# Altium schematic sheet lapwing2p2.SchDoc: lapwing2p2
size A2; Date: 31/08/2021; ApprovedBy: Nick Bassett; Author: Anthony Chiam; CompanyName: UQ Space; DrawnBy: Anthony Chiam; Engineer: Anthony Chiam; Organization: UQ Space; Address1: Room 113, Bldg 74,; Address2: Coopers Road; Address3: UQ St Lucia Campus; Address4: ST LUCIA QLD 4072; DocumentNumber: 1; Revision: 2p2; SheetNumber: 1; SheetTotal: 1; Time: 22:00
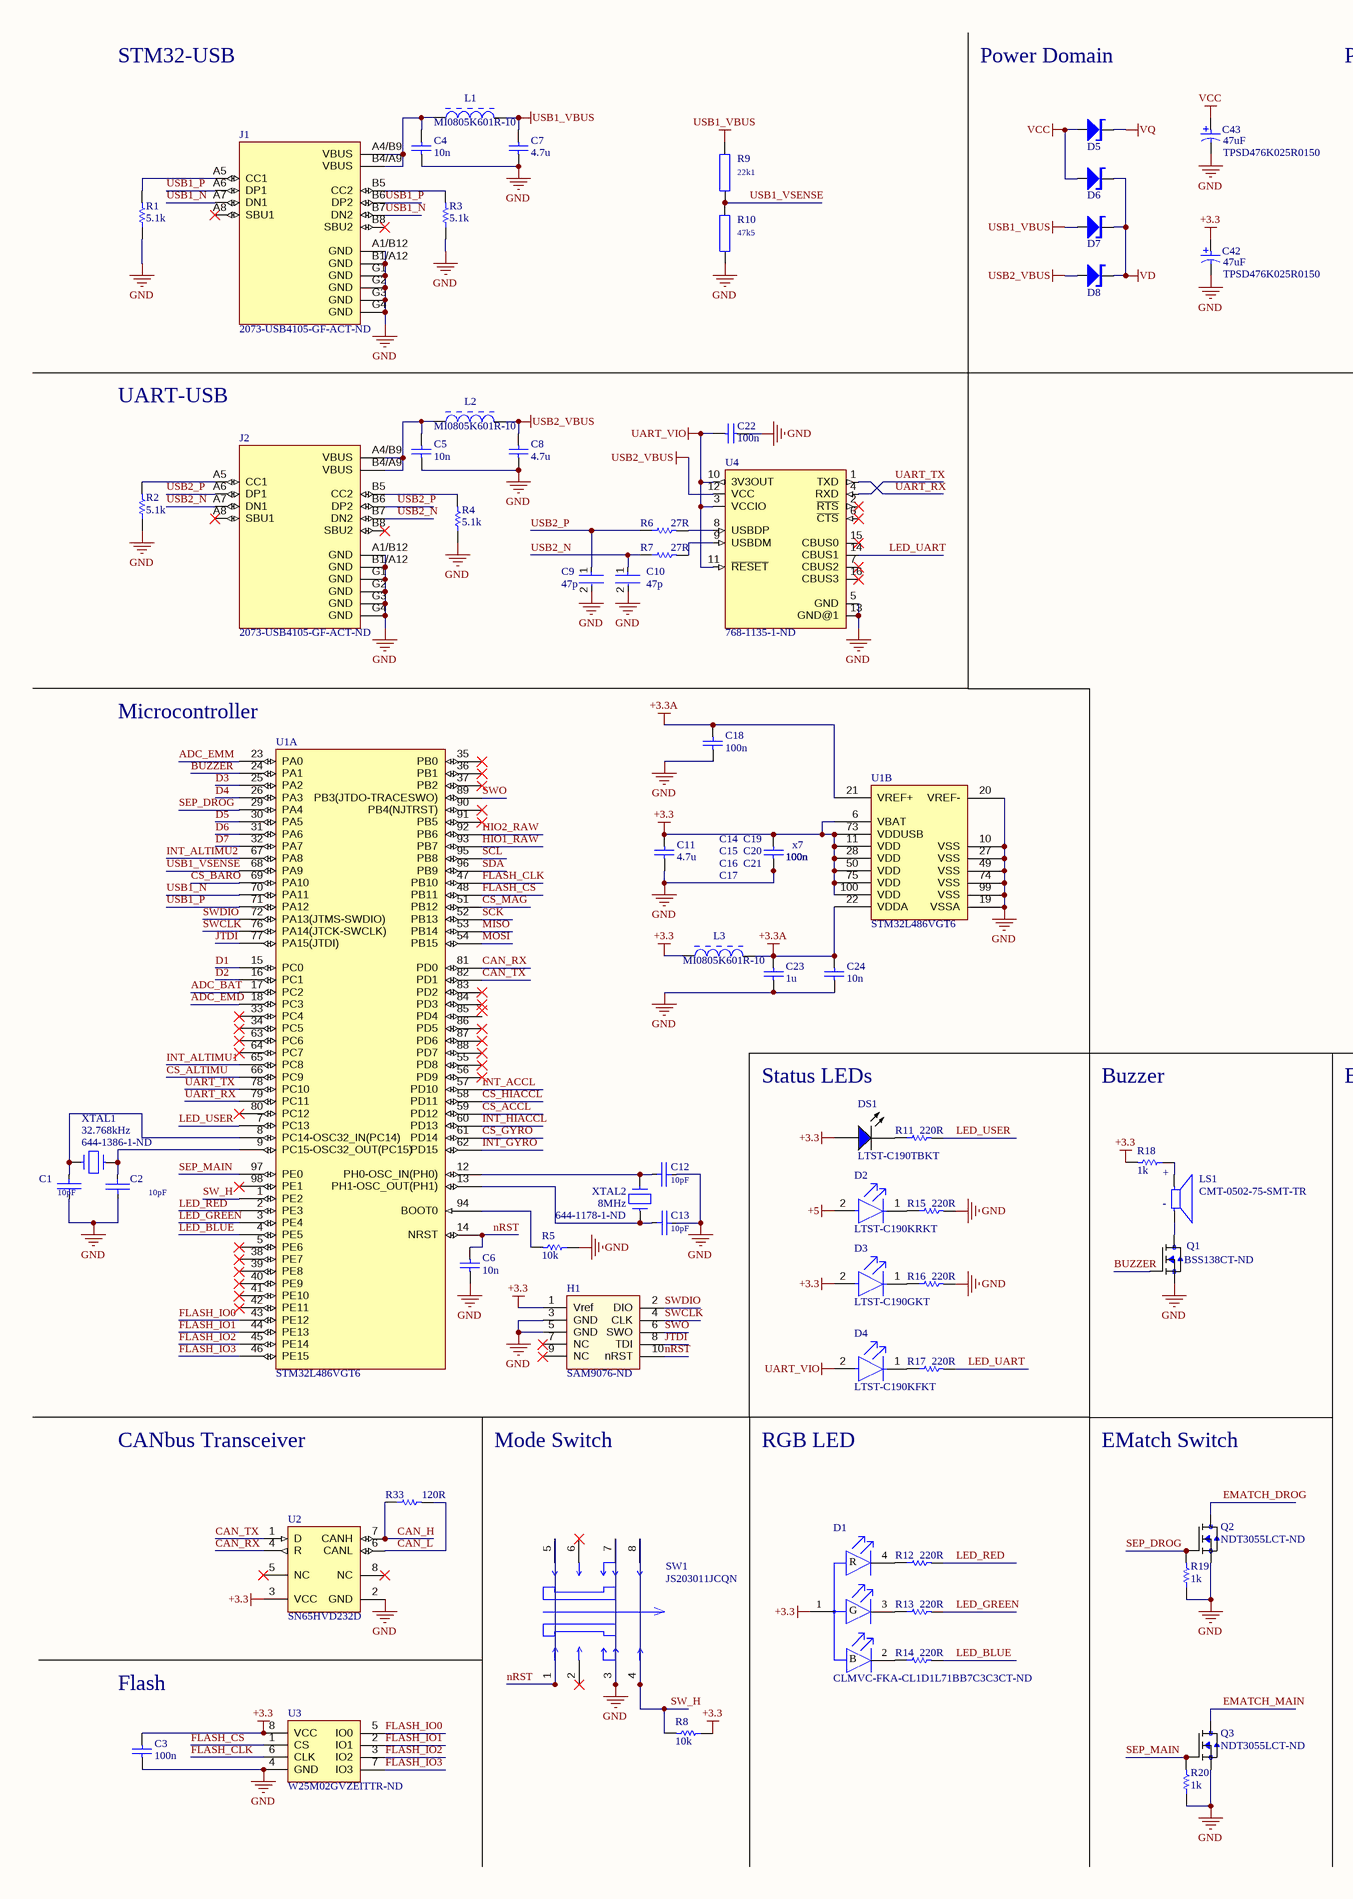
[diagram p0: lapwing2p2.SchDoc, left]
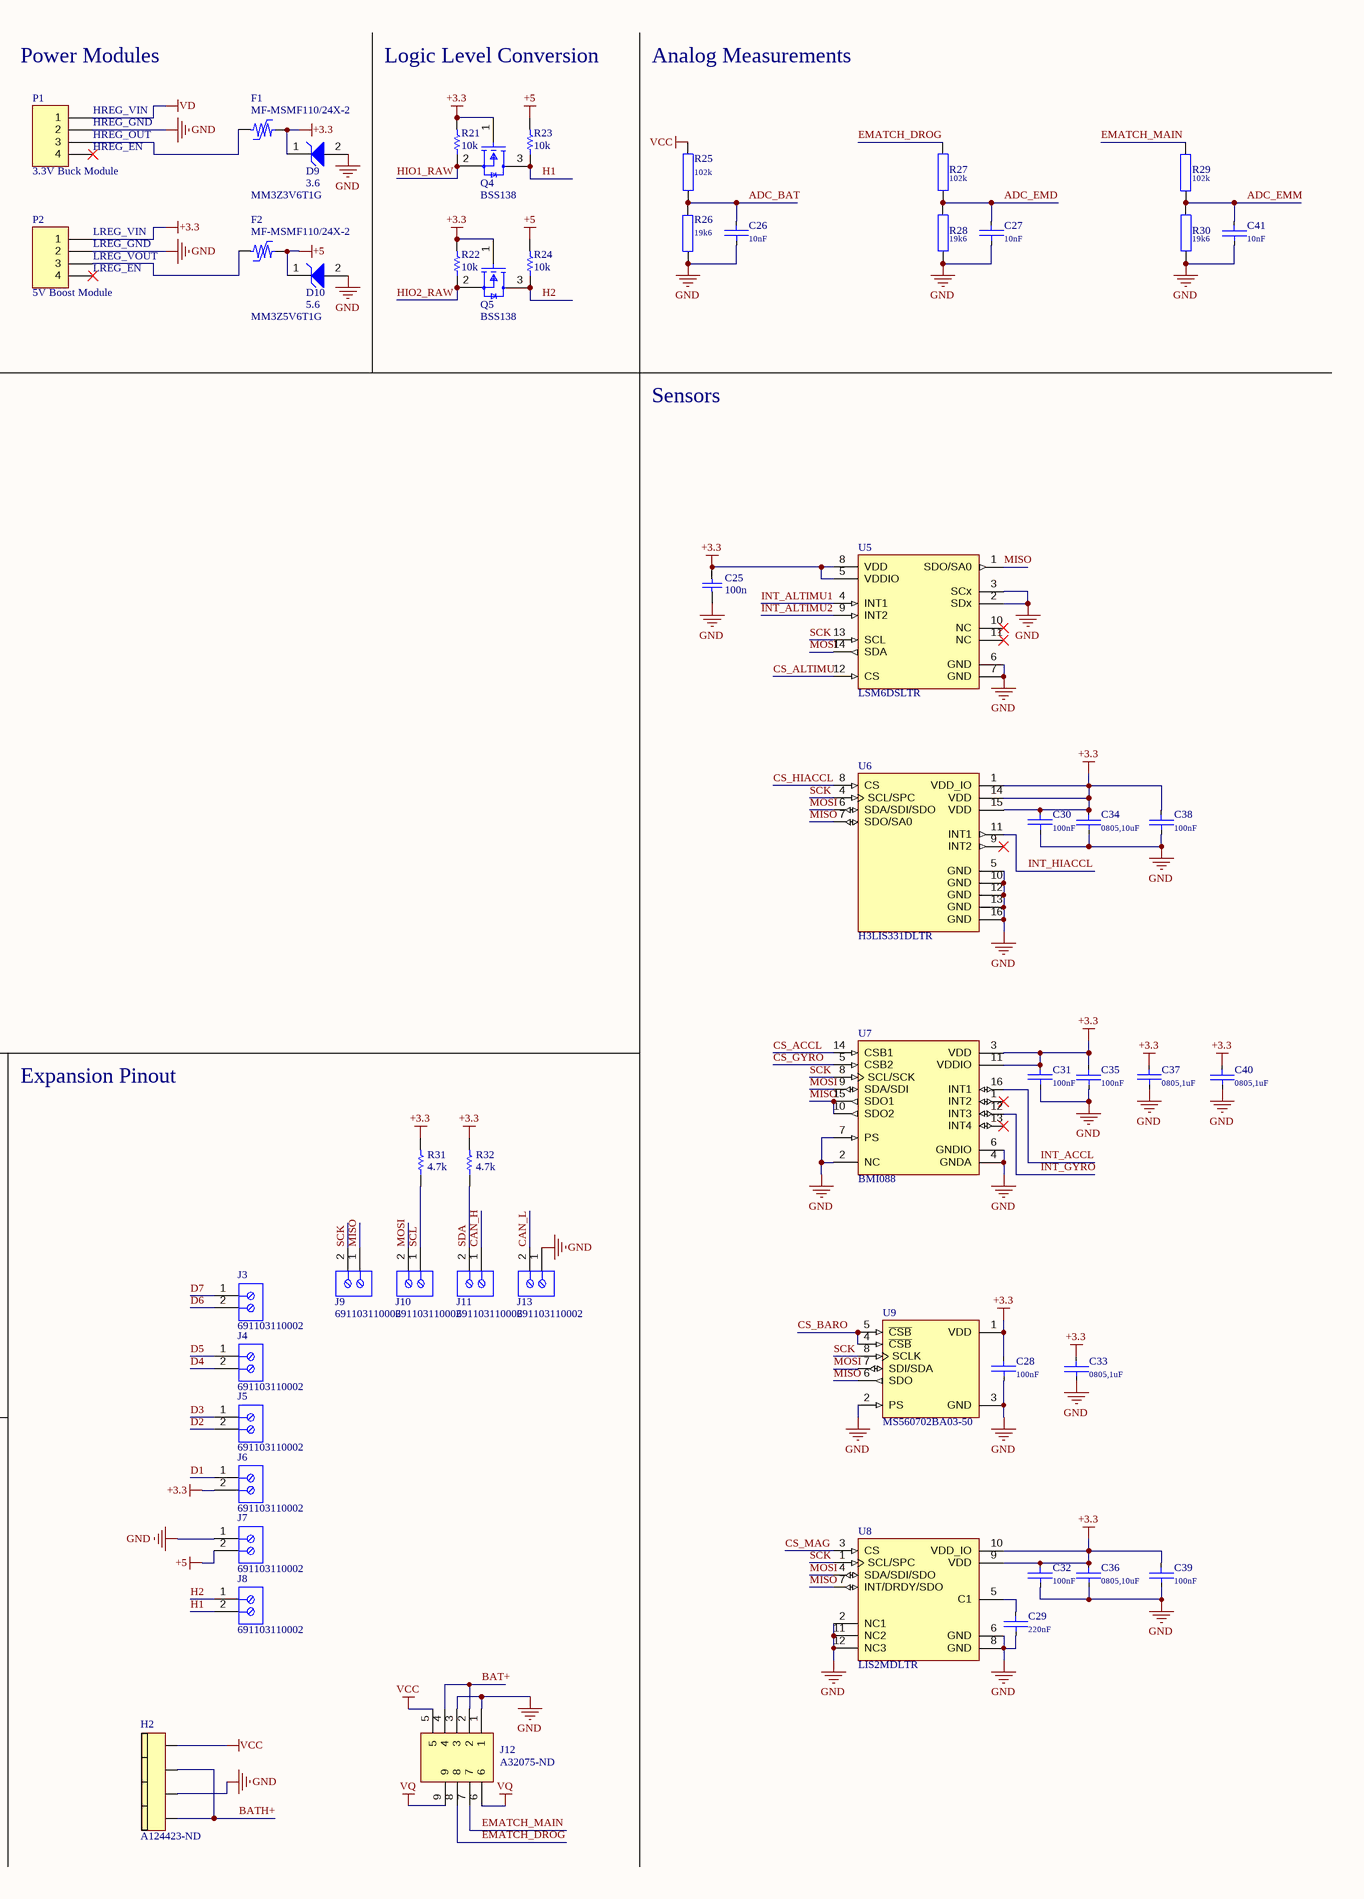
[diagram p1: lapwing2p2.SchDoc, right]

## Parts
C1  CAP  [C0603]  (value not drawn)
C2  CAP  [C0603]  (value not drawn)
C3  value 100n  [CAPC1608X90X35ML10T15]  (hidden comment: GRM188R71H104KA93D)
C4  value 10n  [CAPC1608X90X35ML10T15]  (hidden comment: GRM188R71H103KA01D)
C5  value 10n  [CAPC1608X90X35ML10T15]  (hidden comment: GRM188R71H103KA01D)
C6  value 10n  [CAPC1608X90X35ML10T15]  (hidden comment: GRM188R71H103KA01D)
C7  value 4.7u  [CAPC2013X135X45NL10T25]  (hidden comment: GRM21BR61E475KA12L)
C8  value 4.7u  [CAPC2013X135X45NL10T25]  (hidden comment: GRM21BR61E475KA12L)
C9  value 47p  [FP-C0603C-CF-MFG]  (hidden comment: C0603C470J5GACTU)
C10  value 47p  [FP-C0603C-CF-MFG]  (hidden comment: C0603C470J5GACTU)
C11  value 4.7u  [CAPC2013X135X45NL10T25]  (hidden comment: GRM21BR61E475KA12L)
C12  CAP  [C0603]  (value not drawn)
C13  CAP  [C0603]  (value not drawn)
C14  value 100n  [CAPC1608X90X35ML10T15]  (hidden comment: GRM188R71H104KA93D)
C15  value 100n  [CAPC1608X90X35ML10T15]  (hidden comment: GRM188R71H104KA93D)
C16  value 100n  [CAPC1608X90X35ML10T15]  (hidden comment: GRM188R71H104KA93D)
C17  value 100n  [CAPC1608X90X35ML10T15]  (hidden comment: GRM188R71H104KA93D)
C18  value 100n  [CAPC1608X90X35ML10T15]  (hidden comment: GRM188R71H104KA93D)
C19  value 100n  [CAPC1608X90X35ML10T15]  (hidden comment: GRM188R71H104KA93D)
C20  value 100n  [CAPC1608X90X35ML10T15]  (hidden comment: GRM188R71H104KA93D)
C21  value 100n  [CAPC1608X90X35ML10T15]  (hidden comment: GRM188R71H104KA93D)
C22  value 100n  [CAPC1608X90X35ML10T15]  (hidden comment: GRM188R71H104KA93D)
C23  value 1u  [CAPC1608X90X35NL10T15]  (hidden comment: GRM188R71E105KA12D)
C24  value 10n  [CAPC1608X90X35ML10T15]  (hidden comment: GRM188R71H103KA01D)
C25  value 100n  [CAPC1608X90X35ML10T15]  (hidden comment: GRM188R71H104KA93D)
C26  CAP  [C0603]  (value not drawn)
C27  CAP  [C0603]  (value not drawn)
C28  CAP  [C0603]  (value not drawn)
C29  CAP  [C0603]  (value not drawn)
C30  CAP  [C0603]  (value not drawn)
C31  CAP  [C0603]  (value not drawn)
C32  CAP  [C0603]  (value not drawn)
C33  CAP  [C0805]  (value not drawn)
C34  CAP  [C0805]  (value not drawn)
C35  CAP  [C0603]  (value not drawn)
C36  CAP  [C0805]  (value not drawn)
C37  CAP  [C0805]  (value not drawn)
C38  CAP  [C0603]  (value not drawn)
C39  CAP  [C0603]  (value not drawn)
C40  CAP  [C0805]  (value not drawn)
C41  CAP  [C0603]  (value not drawn)
C42  TPSD476K025R0150  value 47uF  [AVX-7343-31_L]
C43  TPSD476K025R0150  value 47uF  [AVX-7343-31_L]
D1  Supplier Part Number 1: CLMVC-FKA-CL1D1L71BB7C3C3CT-ND  [CLMVC-FKA]  (hidden comment: CLMVC-FKA-CL1D1L71BB7C3C3)
D2  LTST-C190KRKT  [FP-LTST-C190KRKT-MFG]
D3  LTST-C190GKT  [FP-LTST-C190GKT-MFG]
D4  LTST-C190KFKT  [FP-LTST-C190KFKT-MFG]
D5  PMEG6030EVPX  [D_PMEG6030EVPX]  (value not drawn)
D6  PMEG6030EVPX  [D_PMEG6030EVPX]  (value not drawn)
D7  PMEG6030EVPX  [D_PMEG6030EVPX]  (value not drawn)
D8  PMEG6030EVPX  [D_PMEG6030EVPX]  (value not drawn)
D9  MM3Z3V6T1G  VZ Typ (V): 3.6  [ONSC-SOD-323-2-477-02_V]
D10  MM3Z5V6T1G  VZ Typ (V): 5.6  [ONSC-SOD-323-2-477-02_V]
DS1  LTST-C190TBKT  [LTST-C190TBKT-2_V]
F1  MF-MSMF110/24X-2  [BOUR-MF-MSMF110-24X-2_V]
F2  MF-MSMF110/24X-2  [BOUR-MF-MSMF110-24X-2_V]
H1  Supplier Part Number 1: SAM9076-ND  [H_FTSH-105-01-L-DV-K-P]  (hidden comment: FTSH-105-01-L-DV-K-P)
H2  Supplier Part Number 1: A124423-ND  [H_282837-4]  (hidden comment: 282837-4)
J1  Supplier Part Number 1: 2073-USB4105-GF-ACT-ND  [H_GCT_USB4105-GF-A]  (hidden comment: USB4105-GF-A)
J2  Supplier Part Number 1: 2073-USB4105-GF-ACT-ND  [H_GCT_USB4105-GF-A]  (hidden comment: USB4105-GF-A)
J3  691103110002  [691103110002]
J4  691103110002  [691103110002]
J5  691103110002  [691103110002]
J6  691103110002  [691103110002]
J7  691103110002  [691103110002]
J8  691103110002  [691103110002]
J9  691103110002  [691103110002]
J10  691103110002  [691103110002]
J11  691103110002  [691103110002]
J12  Supplier Part Number 1: A32075-ND  [J_5745781-4]  (hidden comment: 5745781-4)
J13  691103110002  [691103110002]
L1  MI0805K601R-10  [LIRD-MI0805K601R-10-2_V]
L2  MI0805K601R-10  [LIRD-MI0805K601R-10-2_V]
L3  MI0805K601R-10  [LIRD-MI0805K601R-10-2_V]
LS1  CMT-0502-75-SMT-TR  [XDCR_CMT-0502-75-SMT-TR]
P1  3.3V Buck Module  [HDR1X4]
P2  5V Boost Module  [HDR1X4]
Q1  Supplier Part Number 1: BSS138CT-ND  [Q_BSS138]  (hidden comment: BSS138)
Q2  Supplier Part Number 1: NDT3055LCT-ND  [Q_NDT3055L]  (hidden comment: NDT3055L)
Q3  Supplier Part Number 1: NDT3055LCT-ND  [Q_NDT3055L]  (hidden comment: NDT3055L)
Q4  BSS138  [FP-318-08-IPC_B]
Q5  BSS138  [FP-318-08-IPC_B]
R1  value 5.1k  [RESC1608X55X30NL15T15]  (hidden comment: ERJ-3EKF5101V)
R2  value 5.1k  [RESC1608X55X30NL15T15]  (hidden comment: ERJ-3EKF5101V)
R3  value 5.1k  [RESC1608X55X30NL15T15]  (hidden comment: ERJ-3EKF5101V)
R4  value 5.1k  [RESC1608X55X30NL15T15]  (hidden comment: ERJ-3EKF5101V)
R5  value 10k  [RESC1609X55X30LL15T15]  (hidden comment: ERJ3EKF1002V)
R6  value 27R  [RESC1608X55X30NL15T15]  (hidden comment: ERJ3EKF27R0V)
R7  value 27R  [RESC1608X55X30NL15T15]  (hidden comment: ERJ3EKF27R0V)
R8  value 10k  [RESC1609X55X30LL15T15]  (hidden comment: ERJ3EKF1002V)
R9  RES  [R0603]  (value not drawn)
R10  RES  [R0603]  (value not drawn)
R11  value 220R  [RESC1608X55X30LL15T15]  (hidden comment: ERJ-3EKF2200V)
R12  value 220R  [RESC1608X55X30LL15T15]  (hidden comment: ERJ-3EKF2200V)
R13  value 220R  [RESC1608X55X30LL15T15]  (hidden comment: ERJ-3EKF2200V)
R14  value 220R  [RESC1608X55X30LL15T15]  (hidden comment: ERJ-3EKF2200V)
R15  value 220R  [RESC1608X55X30LL15T15]  (hidden comment: ERJ-3EKF2200V)
R16  value 220R  [RESC1608X55X30LL15T15]  (hidden comment: ERJ-3EKF2200V)
R17  value 220R  [RESC1608X55X30LL15T15]  (hidden comment: ERJ-3EKF2200V)
R18  value 1k  [RESC1608X55X30ML15T15]  (hidden comment: ERJ-3EKF1001V)
R19  value 1k  [RESC1608X55X30ML15T15]  (hidden comment: ERJ-3EKF1001V)
R20  value 1k  [RESC1608X55X30ML15T15]  (hidden comment: ERJ-3EKF1001V)
R21  value 10k  [RESC1609X55X30LL15T15]  (hidden comment: ERJ3EKF1002V)
R22  value 10k  [RESC1609X55X30LL15T15]  (hidden comment: ERJ3EKF1002V)
R23  value 10k  [RESC1609X55X30LL15T15]  (hidden comment: ERJ3EKF1002V)
R24  value 10k  [RESC1609X55X30LL15T15]  (hidden comment: ERJ3EKF1002V)
R25  RES  [R0603]  (value not drawn)
R26  RES  [R0603]  (value not drawn)
R27  RES  [R0603]  (value not drawn)
R28  RES  [R0603]  (value not drawn)
R29  RES  [R0603]  (value not drawn)
R30  RES  [R0603]  (value not drawn)
R31  value 4.7k  [RESC1608X55X30ML15T15]  (hidden comment: ERJ-3EKF4701V)
R32  value 4.7k  [RESC1608X55X30ML15T15]  (hidden comment: ERJ-3EKF4701V)
R33  value 120R  [RESC0805(2012)_L]  (hidden comment: 120R 1% 0805(2012))
SW1  JS203011JCQN  [JS203011JCQN]
U1  STM32L486VGT6  [STM-LQFP100_L]  (parts A,B of 2)
U2  SN65HVD232D  [D0008A_M]
U3  Supplier Part Number 1: W25M02GVZEITTR-ND  [WSON_VZEIT_WIN-M]  (hidden comment: W25M02GVZEIT)
U4  Supplier Part Number 1: 768-1135-1-ND  [U_FT230XS]  (hidden comment: FT230XS-R)
U5  LSM6DSLTR  [FP-LGA-14L-DM00249496-MFG]
U6  H3LIS331DLTR  [U_H3LIS331DLTR]
U7  BMI088  [U_BMI088]
U8  LIS2MDLTR  [U_LIS2MDL]
U9  MS560702BA03-50  [U_MS560702BA03-50]
XTAL1  value 32.768kHz  Supplier Part Number 1: 644-1386-1-ND  [X_NX3215SA]  (hidden comment: NX3215SA-32.768KHZ-EXS00A-MU00525)
XTAL2  value 8MHz  Supplier Part Number 1: 644-1178-1-ND  [X_NX3225GD]  (hidden comment: NX3225GD-8MHZ-STD-CRA-3)

## Nets
+3.3: C3.2 C11.2 C14.2 C15.2 C16.2 C17.2 C19.2 C20.2 C21.2 C25.2 C28.2(N/A) C30.2(N/A) C31.2(N/A) C32.1(N/A) C33.1(N/A) C34.1(N/A) C35.1(N/A) C36.1(N/A) C37.2(N/A) C38.1(N/A) C39.1(N/A) C40.1(N/A) C42.1 D1.1(COMMON_ANODE) D3.2(A) D9.1(K) DS1.1(A) F1.2 H1.1(Vref) J6.2 L3.1 P2.1 Q4.1(G) Q5.1(G) R8.1 R18.2 R21.2 R22.2 R31.2 R32.2 U1.6(VBAT) U1.11(VDD) U1.28(VDD) U1.50(VDD) U1.73(VDDUSB) U1.75(VDD) U1.100(VDD) U2.3(VCC) U3.8(VCC) U5.5(VDDIO) U5.8(VDD) U6.1(VDD_IO) U6.14(VDD) U6.15(VDD) U7.3(VDD) U7.11(VDDIO) U8.9(VDD) U8.10(VDD_IO) U9.1(VDD)
+3.3A: C18.2 C23.2 C24.2 L3.2 U1.21(VREF+) U1.22(VDDA)
+5: D2.2(A) D10.1(K) F2.2 J7.2 R23.2 R24.2
GND: C1.2(N/A) C2.1(N/A) C3.1 C4.1 C5.1 C6.1 C7.1 C8.1 C9.2 C10.2 C11.1 C12.2(N/A) C13.1(N/A) C14.1 C15.1 C16.1 C17.1 C18.1 C19.1 C20.1 C21.1 C22.2 C23.1 C24.1 C25.1 C26.1(N/A) C27.1(N/A) C28.1(N/A) C29.2(N/A) C30.1(N/A) C31.1(N/A) C32.2(N/A) C33.2(N/A) C34.2(N/A) C35.2(N/A) C36.2(N/A) C37.1(N/A) C38.2(N/A) C39.2(N/A) C40.2(N/A) C41.2(N/A) C42.2 C43.2 D9.2(A) D10.2(A) H1.3(GND) H1.5(GND) H2.2 J1.A1/B12(GND) J1.B1/A12(GND) J1.G1(GND) J1.G2(GND) J1.G3(GND) J1.G4(GND) J2.A1/B12(GND) J2.B1/A12(GND) J2.G1(GND) J2.G2(GND) J2.G3(GND) J2.G4(GND) J7.1 J12.1 J12.3 J13.1 P1.2 P2.2 Q1.S Q2.S Q3.S R1.1 R2.1 R3.1 R4.1 R5.1 R10.1 R15.2 R16.2 R19.1 R20.1 R26.1 R28.2 R30.2 SW1.3 SW1.7 U1.10(VSS) U1.19(VSSA) U1.20(VREF-) U1.27(VSS) U1.49(VSS) U1.74(VSS) U1.99(VSS) U2.2(GND) U3.4(GND) U4.5(GND) U4.13(GND@1) U5.2(SDx) U5.3(SCx) U5.6(GND) U5.7(GND) U6.5(GND) U6.10(GND) U6.12(GND) U6.13(GND) U6.16(GND) U7.2(NC) U7.4(GNDA) U7.6(GNDIO) U7.7(PS) U8.2(NC1) U8.6(GND) U8.8(GND) U8.11(NC2) U8.12(NC3) U9.2(PS) U9.3(GND)
UART_VIO: C22.1 D4.2(A) U4.3(VCCIO) U4.10(3V3OUT) U4.11(~{RESET})
USB1_VBUS: C7.2 D7.A L1.2 R9.2
USB2_VBUS: C8.2 D8.A L2.2 U4.12(VCC)
VCC: C43.1 D5.A D6.A H2.4 J12.5 R25.1
VD: D6.K D7.K D8.K P1.1
VQ: D5.K J12.6 J12.9
ADC_BAT: C26.2(N/A) R25.2 R26.2 U1.17(PC2)
ADC_EMD: C27.2(N/A) R27.2 R28.1 U1.18(PC3)
ADC_EMM: C41.1(N/A) R29.1 R30.1 U1.23(PA0)
BAT+: J12.2 J12.4
BATH+: H2.1 H2.3
BUZZER: Q1.G U1.24(PA1)
CAN_H: J11.1 R33.1 U2.7(CANH)
CAN_L: J13.2 R33.2 U2.6(CANL)
CAN_RX: U1.81(PD0) U2.4(R)
CAN_TX: U1.82(PD1) U2.1(D)
CS_ACCL: U1.59(PD12) U7.14(CSB1)
CS_ALTIMU: U1.66(PC9) U5.12(CS)
CS_BARO: U1.69(PA10) U9.4(~{CSB}) U9.5(~{CSB})
CS_GYRO: U1.61(PD14) U7.5(CSB2)
CS_HIACCL: U1.58(PD11) U6.8(CS)
CS_MAG: U1.51(PB12) U8.3(CS)
D1: J6.1 U1.15(PC0)
D2: J5.2 U1.16(PC1)
D3: J5.1 U1.25(PA2)
D4: J4.2 U1.26(PA3)
D5: J4.1 U1.30(PA5)
D6: J3.2 U1.31(PA6)
D7: J3.1 U1.32(PA7)
EMATCH_DROG: J12.8 Q2.D R27.1
EMATCH_MAIN: J12.7 Q3.D R29.2
FLASH_CLK: U1.47(PB10) U3.6(CLK)
FLASH_CS: U1.48(PB11) U3.1(CS)
FLASH_IO0: U1.43(PE12) U3.5(IO0)
FLASH_IO1: U1.44(PE13) U3.2(IO1)
FLASH_IO2: U1.45(PE14) U3.3(IO2)
FLASH_IO3: U1.46(PE15) U3.7(IO3)
H1: J8.2 Q4.3(D) R23.1
H2: J8.1 Q5.3(D) R24.1
HIO1_RAW: Q4.2(S) R21.1 U1.93(PB7)
HIO2_RAW: Q5.2(S) R22.1 U1.92(PB6)
INT_ACCL: U1.57(PD10) U7.16(INT1)
INT_ALTIMU1: U1.65(PC8) U5.4(INT1)
INT_ALTIMU2: U1.67(PA8) U5.9(INT2)
INT_GYRO: U1.62(PD15) U7.12(INT3)
INT_HIACCL: U1.60(PD13) U6.11(INT1)
JTDI: H1.8(TDI) U1.77(PA15(JTDI))
LED_BLUE: R14.2 U1.4(PE5)
LED_GREEN: R13.2 U1.3(PE4)
LED_RED: R12.2 U1.2(PE3)
LED_UART: R17.2 U4.14(CBUS1)
LED_USER: R11.2 U1.7(PC13)
MISO: J9.1 U1.53(PB14) U5.1(SDO/SA0) U6.7(SDO/SA0) U7.10(SDO2) U7.15(SDO1) U8.7(INT/DRDY/SDO) U9.6(SDO)
MOSI: J10.2 U1.54(PB15) U5.14(SDA) U6.6(SDA/SDI/SDO) U7.9(SDA/SDI) U8.4(SDA/SDI/SDO) U9.7(SDI/SDA)
nRST: C6.2 H1.10(nRST) SW1.1 SW1.5 U1.14(NRST)
SCK: J9.2 U1.52(PB13) U5.13(SCL) U6.4(SCL/SPC) U7.8(SCL/SCK) U8.1(SCL/SPC) U9.8(SCLK)
SCL: J10.1 R31.1 U1.95(PB8)
SDA: J11.2 R32.1 U1.96(PB9)
SEP_DROG: Q2.G R19.2 U1.29(PA4)
SEP_MAIN: Q3.G R20.2 U1.97(PE0)
SW_H: R8.2 SW1.4 SW1.8 U1.1(PE2)
SWCLK: H1.4(CLK) U1.76(PA14(JTCK-SWCLK))
SWDIO: H1.2(DIO) U1.72(PA13(JTMS-SWDIO))
SWO: H1.6(SWO) U1.89(PB3(JTDO-TRACESWO))
UART_RX: U1.79(PC11) U4.1(TXD)
UART_TX: U1.78(PC10) U4.4(RXD)
USB1_N: J1.A7(DN1) J1.B7(DN2) U1.70(PA11)
USB1_P: J1.A6(DP1) J1.B6(DP2) U1.71(PA12)
USB1_VSENSE: R9.1 R10.2 U1.68(PA9)
USB2_N: C10.1 J2.A7(DN1) J2.B7(DN2) R7.1
USB2_P: C9.1 J2.A6(DP1) J2.B6(DP2) R6.1
NetC1_1: C1.1(N/A) U1.8(PC14-OSC32_IN(PC14)) XTAL1.2
NetC2_2: C2.2(N/A) U1.9(PC15-OSC32_OUT(PC15)) XTAL1.1
NetC4_2: C4.2 J1.A4/B9(VBUS) J1.B4/A9(VBUS) L1.1
NetC5_2: C5.2 J2.A4/B9(VBUS) J2.B4/A9(VBUS) L2.1
NetC12_1: C12.1(N/A) U1.12(PH0-OSC_IN(PH0)) XTAL2.2
NetC13_2: C13.2(N/A) U1.13(PH1-OSC_OUT(PH1)) XTAL2.1
NetC29_1: C29.1(N/A) U8.5(C1)
NetD1_2: D1.2(BLUE_C) R14.1
NetD1_3: D1.3(GREEN_C) R13.1
NetD1_4: D1.4(RED_C) R12.1
NetD2_1: D2.1(C) R15.1
NetD3_1: D3.1(C) R16.1
NetD4_1: D4.1(C) R17.1
NetDS1_2: DS1.2(K) R11.1
NetF1_1: F1.1 P1.3
NetF2_1: F2.1 P2.3
NetJ1_A5: J1.A5(CC1) R1.2
NetJ1_B5: J1.B5(CC2) R3.2
NetJ2_A5: J2.A5(CC1) R2.2
NetJ2_B5: J2.B5(CC2) R4.2
NetLS1_N: LS1.N Q1.D
NetLS1_P: LS1.P R18.1
NetR5_2: R5.2 U1.94(BOOT0)
NetR6_2: R6.2 U4.8(USBDP)
NetR7_2: R7.2 U4.9(USBDM)

Not connected (* = marked no-connect by the designer): H1 7(NC)* 9(NC)*; J1 A8(SBU1)* B8(SBU2)*; J2 A8(SBU1)* B8(SBU2)*; P1 4*; P2 4*; SW1 2* 6*; U1 5(PE6)* 33(PC4)* 34(PC5)* 35(PB0)* 36(PB1)* 37(PB2)* 38(PE7)* 39(PE8)* 40(PE9)* 41(PE10)* 42(PE11)* 55(PD8)* 56(PD9)* 63(PC6)* 64(PC7)* 80(PC12)* 83(PD2)* 84(PD3)* 85(PD4) 86(PD5)* 87(PD6)* 88(PD7)* 90(PB4(NJTRST))* 91(PB5)* 98(PE1)*; U2 5(NC)* 8(NC)*; U4 2(~{RTS})* 6(~{CTS})* 7(CBUS2)* 15(CBUS0)* 16(CBUS3)*; U5 10(NC)* 11(NC)*; U6 9(INT2)*; U7 1(INT2)* 13(INT4)*

## Notes on the sheet
- STM32-USB
- Power Domain
- Power Modules
- Logic Level Conversion
- Analog Measurements
- (near P1) HREG_VIN
- (near P1) HREG_GND
- (near P1) HREG_OUT
- (near P1) HREG_EN
- (near R9) 22k1
- (near R25) 102k
- (near R27) 102k
- (near R29) 102k
- (near R10) 47k5
- (near P2) LREG_VIN
- (near P2) LREG_GND
- (near P2) LREG_VOUT
- (near P2) LREG_EN
- (near R26) 19k6
- (near C26) 10nF
- (near R28) 19k6
- (near C27) 10nF
- (near R30) 19k6
- (near C41) 10nF
- UART-USB
- Sensors
- (near U1) Microcontroller
- 100nF
- 0805,10uF
- (near C38) 100nF
- x7
- Status LEDs
- Buzzer
- Expansion Pinout
- (near C35) 100nF
- (near C37) 0805,1uF
- (near C40) 0805,1uF
- (near C1) 10pF
- (near C2) 10pF
- (near C12) 10pF
- (near C13) 10pF
- (near C28) 100nF
- (near C33) 0805,1uF
- CANbus Transceiver
- Mode Switch
- RGB LED
- EMatch Switch
- (near C39) 100nF
- (near C29) 220nF
- Flash
- DWG NO:
- REV:
- THIS DOCUMENT AND THE DATA DISCLOSED HEREIN OR
- HEREWITH IS THE PROPERTY OF ALTIUM LIMITED AND MAY
- BE FREELY DISTRIBUTED IN WHOLE. NO RIGHTS ARE
- RESERVED OR EXPRESS OR IMPLIED WARANTEE GIVEN.
- REVISION
- DESCRIPTION
- DATE
- APPROVED
- ENG:
- APPROVALS
- PROJECT
- DSN:
- CHK:
- REFERENCE DOCUMENTS
- PROJECT REVISION:
- TITLE
- DOCUMENT REVISION:
- DESIGN ITEM:
- BOM:
- FAB DWG:
- PCB DWG:
- ASSY DWG:
- SCALE:
- A2
- SIZE
- CAGE CODE
- FILE NAME
- DWG NO.
- SHEET
- OF
- REV
- (in symbol CLMVC-FKA-CL1D1L71BB7C3C3) R; G; B
- (in symbol CMT-0502-75-SMT-TR) +; -

## Library data of the parts
C1 C2 C12 C13 = CAP: CAPACITOR; Value: 10pF
C3 C14-C22 C25 = CMP-2100-03643-1: Chip Capacitor, 0.1 uF, +/- 10%, 50 V, -55 to 125 degC, 0603 (1608 Metric), RoHS, Tape and Reel; Manufacturer: Murata; Dielectric Material: Ceramic; Voltage Rating: 50V; Capacitance: 100nF; Dielectric: X7R; Insulation Resistance: 10GR; Case Code (Metric): 1608; Lead Free: LeadFree; Depth: 0.8mm; Number of Pins: 2; Radiation Hardening: No; Case/Package: 0603; Manufacturer URL: http://www.murata.com/; Packaging: TapeandReel; Length: 1.6mm; Contact Plating: Tin; Datasheet URL: http://psearch.en.murata.com/capacitor/product/GRM188R71H104KA93%23.pdf; Tolerance: 10%; Case Code (Imperial): 0603; Min Operating Temperature: -55degC; RoHSCompliant: true; Voltage: 50V; Termination: SMD/SMT; Mount: SurfaceMount; Material: Ceramic; Package Quantity: 1; Height: 0.8mm; Thickness: 0.035inch; REACH SVHC: NoSVHC; Max Operating Temperature: 125degC; Width: 0.8mm; Package Reference: 0603; Voltage Rating (DC): 50V; Datasheet Version: 42675.0; Package Description: 2-Pin Surface Mount Device, Body 1.6 x 0.8 mm
C4-C6 C24 = CMP-2100-03642-1: Chip Capacitor, 10 nF, +/- 10%, 50 V, -55 to 125 degC, 0603 (1608 Metric), RoHS, Tape and Reel; Manufacturer: Murata; Insulation Resistance: 10GR; Dielectric: X7R; Voltage Rating: 50V; Capacitance: 10nF; Material: Ceramic; Package Quantity: 1; Lead Free: LeadFree; Case/Package: 0603; Termination: SMD/SMT; REACH SVHC: Unknown; Manufacturer URL: http://www.murata.com/; Datasheet URL: http://search.murata.co.jp/Ceramy/image/img/A01X/G101/ENG/GRM188R71H103KA01-01.pdf; Mount: SurfaceMount; Datasheet Version: 42401.0; Number of Pins: 2; Length: 1.6mm; Voltage: 50V; Depth: 0.8mm; Tolerance: 10%; Min Operating Temperature: -55degC; Voltage Rating (DC): 50V; Max Operating Temperature: 125degC; Package Description: 2-Pin Surface Mount Device, Body 1.6 x 0.8 mm; RoHSCompliant: True; Case Code (Imperial): 0603; Width: 0.031inch; Case Code (Metric): 1608; Height: 0.8mm; Package Reference: 0603; Packaging: TapeandReel; Thickness: 0.035inch; Dielectric Material: Ceramic
C7 C8 C11 = CMP-2007-03545-1: Manufacturer: Murata; Part Number: GRM21BR61E475KA12L
C9 C10 = CMP-1035-01063-3: CAP CER 47PF 50V C0G/NP0 0603; Manufacturer: KEMET; Automotive Grade: Grade 1; Material: Ceramic; Tolerance: 0.05; Temperature Coefficient: 30ppm/°C; Temperature Characteristic: C0G; Manufacturer Part Number: C0603C470J5GACTU; Package: C0603C-CF; Capacitance: 47 pF; Device Class L2: Capacitors; Height: 0.87mm; Automotive: Yes; Device Class L3: Ceramic Capacitors; RoHS: TRUE; Category: Cap; Digikey Description: CAP CER 47PF 50V C0G/NP0 0603; Octopart: https://octopart.com/c0603c470j5gactu-kemet-96565; Mouser Description: Capacitor; Ceramic; Cap; 47.0pF; Tol+5%; SMT; Vol-Rtg 50V; C0G; TR; ComponentLink2Description: Datasheet; Voltage Rating: 50 V; Lead Free: Yes; Temperature Range Low: -55°C; ComponentLink2URL: https://api.kemet.com/component-edge/download/datasheet/C0603C100J5GACAUTO.pdf; Device Class L1: Passive Components; Temperature Range High: +125°C; Temperature: -55°C to +125°C
C23 = CMP-2006-02460-1: Manufacturer: Murata; Part Number: GRM188R71E105KA12D
C26 C27 C41 = CAP: CAPACITOR; Value: 10nF
C28 C30-C32 C35 C38 C39 = CAP: CAPACITOR; Value: 100nF
C29 = CAP: CAPACITOR; Value: 220nF
C33 C37 C40 = CAP: CAPACITOR; Value: 1uF
C34 C36 = CAP: CAPACITOR; Value: 10uF
C42 C43 = CMP-2000-07307-1: Tantalum Capacitor, 47 uF, +/- 10%, 25 V, -55 to 125 degC, 2-Pin SMD, Tape and Reel; Mfr Case Code: DCase; Brand: AVX; Leakage Current: 11.8uA; Dissipation Factor DF: 6; Ripple Current: 0.4mA; Voltage Rating: 25V; Qualification: Commercial; Unit Weight: 0.023634oz; ESR: 150mOhms; Product: TantalumSolidLowESRStandardGrade; Case Code - mm: 7343; Manufacturer URL: http://www.avx.com/; Datasheet Version: 02/2004; Length: 7.3mm; Packaging: Reel; Mounting Technology: SurfaceMount; Minimum Operating Temperature: -55C; Maximum Operating Temperature: +125C; Series: TPS; Case Code - in: 2917; Height: 3.1mm; Package Description: 2-Pin Surface Mount Device, Body 7.3 x 4.35 mm; Operating Temperature Range: -55Cto+125C; Product Category: TantalumCapacitors-SolidSMD; RoHS: True; Tolerance: 10%; Package / Case: 2917(7343metric); Package Reference: 7343-31; Capacitance: 47uF; Termination Style: SMD/SMT; Width: 4.3mm; Datasheet URL: https://datasheet.ciiva.com/11793/0900766b80066cb4-11793194.pdf; Manufacturer: AVX
D1 = CLMVC-FKA-CL1D1L71BB7C3C3: LED RGB CLEAR 4PLCC SMD; MF: Cree Inc.; Digi-Key_Part_Number: CLMVC-FKA-CL1D1L71BB7C3C3CT-ND; Digi-Key_Purchase_URL: https://www.digikey.com.au/product-detail/en/cree-inc/CLMVC-FKA-CL1D1L71BB7C3C3/CLMVC-FKA-CL1D1L71BB7C3C3CT-ND/9094273; MP: CLMVC-FKA-CL1D1L71BB7C3C3; Package: 4-PLCC; SnapEDA_Link: https://www.snapeda.com/parts/CLMVC-FKA-CL1D1L71BB7C3C3/Cree%20Inc./view-part/; Value: *; Supplier 1: Digi-Key
D2 = CMP-1674-00011-2: LED RED CLEAR CHIP SMD; Reverse Voltage: 5V; Viewing Angle: 130°; Power Rating: 75mW; Test Current: 20mA; Number of Elements: 1; Lens Color: Colorless; Wavelength: 639nm; Dominant Wavelength: 631nm; Lens Style: Diffused; Forward Current: 30mA; Forward Voltage: 2.4V; Luminous Intensity: 54mcd; Color: Red; Case Code (Imperial): 0603; Lens Transparency: Clear; Lead Free: Lead Free; Package Quantity: 1; Packaging: Tape and Reel; Max Operating Temperature: 85°C; Number of Pins: 2; Height: 0.8mm; Case/Package: 0603; Number of LEDs: 1; Width: 0.8mm; Case Code (Metric): 1608; Depth: 0.8mm; Mount: Surface Mount; Radiation Hardening: No; Length: 1.6mm; Illumination Color: Red; Power Dissipation: 75mW; Min Operating Temperature: -55°C
D3 = CMP-22017-000005-2: LED GREEN CLEAR CHIP SMD; Dominant Wavelength: 569nm; Reverse Voltage: 5V; Lens Color: Colorless; Viewing Angle: 130°; Voltage: 2V; Forward Current: 30mA; Power Dissipation: 100mW; Luminous Intensity: 6mcd; Number of LEDs: 1; Forward Voltage: 2.1V; Wavelength: 565nm; Test Current: 10mA; Min Operating Temperature: -55°C; Lens Style: Clear; Mount: Surface Mount; Width: 0.8mm; Packaging: Tape and Reel; Lens Transparency: Clear; Case Code (Metric): 1608; Depth: 0.8mm; Case Code (Imperial): 0603; Case/Package: 0603; Number of Pins: 2; Max Operating Temperature: 85°C; Lead Free: Lead Free; Number of Elements: 1; Length: 1.6mm; Height: 0.8mm; Package Quantity: 1; Power Rating: 100mW; Radiation Hardening: No; Illumination Color: Green; Color: Green
D4 = CMP-1674-00008-2: LED ORANGE CLEAR CHIP SMD; Number of LEDs: 1; Reverse Voltage: 5V; Power Rating: 75mW; Lens Style: Diffused; Wavelength: 611nm; Forward Voltage: 2V; Test Current: 20mA; Lens Color: Colorless; Dominant Wavelength: 605nm; Forward Current: 30mA; Viewing Angle: 130°; Luminous Intensity: 90mcd; Depth: 1.6mm; Length: 3.2mm; Width: 0.8mm; Lead Free: Lead Free; Height: 0.8mm; Radiation Hardening: No; Max Operating Temperature: 85°C; Illumination Color: Orange; Power Dissipation: 75mW; Packaging: Tape and Reel; Lens Transparency: Clear; Min Operating Temperature: -55°C; Package Quantity: 1; Case Code (Metric): 1608; Number of Pins: 2; Case Code (Imperial): 0603; Case/Package: 0603; Number of Elements: 1; Color: Orange; Mount: Surface Mount
D5-D8 = PMEG6030EVPX: DIODE SCHOTTKY 60V 3A SOD128
D9 = CMP-1060-00650-1: Zener Voltage Regulator, 300 mW, 2-Pin SOD-323, Pb-Free, Tape and Reel; Manufacturer: On Semiconductor; P Max (W): 0.3; RoHS: Pb-Free; ComponentLink1URL: http://www.onsemi.com/; PackageVersion: Rev. H, 03/2007; PartNumber: MM3Z3V6T1G; ComponentLink2Description: Datasheet; ComponentLink2URL: http://www.onsemi.cn/pub_link/Collateral/MM3Z2V4T1-D.PDF; DatasheetVersion: Rev. 9; PackageReference: SOD-323-2-477-02; ComponentLink3URL: http://www.onsemi.com/pub_link/Collateral/477-02.PDF.1; Packing: Tape and Reel; Mounting Technology: Surface Mount; ComponentLink3Description: Package Specification; PackageDescription: 2-Pin SOD, Body 1.7 x 1.25 mm; ComponentLink1Description: Manufacturer URL
D10 = CMP-1060-00704-1: Zener Voltage Regulator, 300 mW, 2-Pin SOD-323, Pb-Free, Tape and Reel; Manufacturer: On Semiconductor; P Max (W): 0.3; PackageReference: SOD-323-2-477-02; ComponentLink1Description: Manufacturer URL; ComponentLink1URL: http://www.onsemi.com/; PackageVersion: Rev. H, 03/2007; PartNumber: MM3Z5V6T1G; ComponentLink3Description: Package Specification; DatasheetVersion: Rev. 9; ComponentLink3URL: http://www.onsemi.com/pub_link/Collateral/477-02.PDF.1; PackageDescription: 2-Pin SOD, Body 1.7 x 1.25 mm; RoHS: Pb-Free; Packing: Tape and Reel; ComponentLink2URL: http://www.onsemi.cn/pub_link/Collateral/MM3Z2V4T1-D.PDF; ComponentLink2Description: Datasheet; Mounting Technology: Surface Mount
DS1 = CMP-1674-00010-1: Single Color Chip LED, 2.8 to 3.8 V, 28 to 180 mcd, -20 to 80 degC, 2-Pin SMD, RoHS, Tape and Reel; Nominal Supply Voltage: 3 V; Min Supply Voltage: 2.1 V; Interface: Serial; Case\Package: DFN; Max Supply Voltage: 3.6 V; Min Operating Temperature: -40 degC; ComponentLink2URL: http://optoelectronics.liteon.com/upload/download/DS-22-99-0224/S_110_LTST-C190TBKT(0630).pdf; Length: 3 mm; PackageReference: C190TBKT-2; Packaging: Cut Tape; RoHSCompliant: true; DatasheetVersion: Rev. K, 08/2011; Width: 3 mm; Pins: 6; Height: 1.1 mm; Max Operating Temperature: 125 degC; Mount: Surface Mount; PackageDescription: 2-Pin Surface Mount Device, Body 1.6 x 0.8 mm; ComponentLink1Description: Manufacturer URL; ComponentLink1URL: http://www.us.liteon.com/; REACH SVHC: No SVHC; ComponentLink2Description: Datasheet
F1 F2 = CMP-2100-03655-1: PTC Resettable Fuse, 24 V, 1.1 A, -40 to 85 degC, 2-Pin SMD, RoHS, Tape and Reel; Manufacturer: Bourns; Max Current Rating: 20A; Power Dissipation: 800mW; Supply Voltage: 24V; Number of Terminals: 2; Max Operating Temperature: 85degC; Case Code (Metric): 4532; Width: 3.41mm; RoHSCompliant: true; Contact Plating: Gold; Package Reference: MF-MSMF110-24X-2; Min Operating Temperature: -40degC; Packaging: TapeandReel; Mount: SurfaceMount; Case Code (Imperial): 1812; Length: 4.83mm; Height: 1.6mm; Case/Package: 1812; Datasheet URL: http://www.bourns.com/docs/Product-Datasheets/mfmsmf.pdf; Datasheet Version: Rev. AG, 08/2016; Voltage Rating: 24V; REACH SVHC: NoSVHC; Voltage Rating (DC): 24V; Radiation Hardening: No; Package Description: 2-Pin Surface Mount Device, Body 4.6 x 3.24 mm; Manufacturer URL: http://www.bourns.com/
H1 = FTSH-105-01-L-DV-K-P: CONN HEADER SMD 10POS 1.27MM; ComponentLink1Description: DigiKey; ComponentLink1URL: https://www.digikey.com.au/product-detail/en/samtec-inc/FTSH-105-01-L-DV-K-P/SAM9076-ND/6613384; Supplier 1: Digi-Key
H2 = 282837-4: TERM BLK 4P SIDE ENT 5.08MM PCB; Supplier 1: Digi-Key
J1 J2 = USB4105-GF-A: CONN RCPT USB2.0 TYPEC 5A; MF: GCT; SnapEDA_Link: https://www.snapeda.com/parts/USB4105-GF-A/Global%20Connector%20Technology/view-part/4423780/?ref=snap; Price: None; Availability: Unavailable; Package: None; MP: USB4105-GF-A; Value: *; Supplier 1: Digi-Key
J3-J11 J13 = CMP-1502-03254-1: Series 1031 - 3.50 mm Horizontal Entry Modular with Pressure Clamp WR-TBL, 2 pin; Manufacturer: Wurth Elektronik; Pin Number: 2; Pitch: 3.50mm; Datasheet URL: http://katalog.we-online.de/em/datasheet/6911031100xx.pdf; Package Reference: 691103110002; Publisher: WurthElektronik; Manufacturer URL: http://www.we-online.de; Mounting Technology: THT; Operating Temperature: -40to105degC; Part Number: 691103110002; Packaging: Box
J12 = 5745781-4: CONN D-SUB RCPT 9POS R/A SOLDER; Centerline_Pitch: 2.74 mm[.108 in]; Number_of_Positions: 9; Product_Type: Connector; MF: TE Connectivity; Digi-Key_Part_Number: A32075-ND; Digi-Key_Purchase_URL: https://www.digikey.com/product-detail/en/te-connectivity-amp-connectors/5745781-4/A32075-ND/808630?utm_source=snapeda&utm_medium=aggregator&utm_campaign=symbol; Package: None; MP: 5745781-4; Value: *; EU_RoHS_Compliance: Compliant; TE_purchase_URL: https://www.te.com/usa-en/product-5745781-4.html?te_bu=Cor&te_type=disp&te_campaign=seda_glo_cor-seda-global-disp-prtnr-fy19-seda-model-bom-cta_sma-317_1&elqCampaignId=32493; SnapEDA_Link: https://www.snapeda.com/parts/5745781-4/TE%20Connectivity%20AMP%20Connectors/view-part/2374514/?ref=snap; Comment_1: *; Supplier 1: Digi-Key
L1-L3 = CMP-2000-05196-1: Chip Bead for Power Filtering, 1500 mA, 600 Ohm, -40 to 125 degC, 0805 (2012 Metric), RoHS, Tape and Reel; Manufacturer: Laird; Filter Type: PowerLine; Current Rating (Max): 1.5A; Catalog Drawings: (HI,HZ,LI,MI)0805Series_1.10mmMax.Height; Impedance @ Frequency: 600Ohm@100MHz; Number of Lines: 1; DC Resistance (DCR) (Max): 100mOhm; Other Names: 240-2390-1; Kits: 240-2227-ND-KITEMIFERRITEBEADCHIPSMD; Online Catalog: MISeries; Standard Package: 1; Datasheet Version: Rev. A, 01/2004; Height (Max): 0.043"(1.10mm); Category: Filters; Operating Temperature: -40degC~125degC; Package Description: 2-Pin Surface Mount Device, Body 2 x 1.25 mm; Package / Case: 0805(2012Metric); Package Reference: MI0805K601R-10-2; Packaging: CutTape(CT); Ratings: -; Mounting Type: SurfaceMount; Datasheet URL: https://datasheet.ciiva.com/3082/mi0805k601r-10-a-vp-3082219.pdf; Size / Dimension: 0.079"Lx0.049"W(2.00mmx1.25mm); Family: FerriteBeadsandChips; Manufacturer URL: https://www.lairdtech.com; Series: MI
LS1 = CMT-0502-75-SMT-TR: BUZZER, 5 MM, 2 MM DEEP, M, 3 V,; MF: CUI Devices; Price: None; Value: *; MP: CMT-0502-75-SMT-TR; Package: CUI Devices; CUI_purchase_URL: https://www.cuidevices.com/product/audio/buzzers/audio-transducers/cmt-0502-75-smt-tr?utm_source=snapeda.com&utm_medium=referral&utm_campaign=snapedaBOM; SnapEDA_Link: https://www.snapeda.com/parts/CMT-0502-75-SMT-TR/CUI%20Devices/view-part/3662555/?ref=snap; Availability: Unavailable
P1 P2 = Header 4: Header, 4-Pin; LatestRevisionDate: 17-Jul-2002; LatestRevisionNote: Re-released for DXP Platform.; Publisher: Altium Limited
Q1 = BSS138: MOSFET N-CH 50V 220MA SOT-23; Supplier 1: Digi-Key
Q2 Q3 = NDT3055L: MOSFET N-CH 60V 4A SOT-223-4; Supplier 1: Digi-Key
Q4 Q5 = CMP-07173-000101-1: MOSFET N-CH 50V 220MA SOT-23; Turn-Off Delay Time: 20ns; Element Configuration: Single; Rds On Max: 3.5R; Gate to Source Voltage (Vgs): 20V; Threshold Voltage: 1.3V; Number of Elements: 1; Power Dissipation: 360mW; Rise Time: 9ns; Turn-On Delay Time: 2.5ns; Input Capacitance: 27pF; On-State Resistance: 6R; Lead Free: Lead Free; Length: 2.92mm; Width: 1.3mm; Drain to Source Breakdown Voltage: 50V; Min Operating Temperature: -55°C; REACH SVHC: No SVHC; Packaging: Tape and Reel; Radiation Hardening: No; Height: 0.93mm; Drain to Source Voltage (Vdss): 50V; Current Rating: 220mA; Voltage Rating (DC): 50V; Weight: 0.03g; Continuous Drain Current (ID): 220mA; Number of Pins: 3; Nominal Vgs: 1.3V; Max Power Dissipation: 360mW; Fall Time: 9ns; Drain to Source Resistance: 3.5R; Contact Plating: Tin; Case/Package: SOT-23; Package Quantity: 1; Dual Supply Voltage: 50V; Mount: Surface Mount; Termination: SMD/SMT; Max Operating Temperature: 150°C
R1-R4 = CMP-2000-00540-1: Manufacturer: Panasonic; Part Number: ERJ-3EKF5101V
R5 R8 R21-R24 = CMP-1012-00623-3: Chip Resistor, 10 KOhm, +/- 1%, 0.1 W, -55 to 155 degC, 0603 (1608 Metric), RoHS, Tape and Reel; Manufacturer: Panasonic; Voltage Rating: 75V; Case\/Package: 0603; Power Rating: 100mW; Resistance: 10KOhm; Temperature Coefficient: 100ppm\/degreesC; Number of Pins: 2; Package Reference: 603; Depth: 0.8mm; Mount: SurfaceMount; Package Description: 2-Pin Surface Mount Device, Body 1.6 x 0.85 mm; Datasheet Version: 02/2017; Length: 1.6mm; Lead Free: LeadFree; Height: 0.45mm; Number of Terminations: 2; Max Power Dissipation: 100mW; Min Operating Temperature: -55degC; Datasheet URL: https://industrial.panasonic.com/cdbs/www-data/pdf/RDA0000/AOA0000C304.pdf; Termination: SMD/SMT; Case Code (Metric): 1608; Case Code (Imperial): 0603; Tolerance: 1%; Max Operating Temperature: 155degC; RoHSCompliant: true; Voltage Rating (DC): 75V; Radiation Hardening: No; Packaging: TapeandReel; Composition: ThickFilm; Mounting Technology: SurfaceMount; Manufacturer URL: http://www.panasonic.com/; Width: 0.031inch; REACH SVHC: NoSVHC; Contact Plating: Tin; Military Standard: Not; Package Quantity: 1
R6 R7 = CMP-2000-00396-1: Manufacturer: Panasonic; Part Number: ERJ3EKF27R0V
R9 = RES: RESISTOR; Value: 22k1
R10 = RES: RESISTOR; Value: 47k5
R11-R17 = CMP-2000-00335-2: Chip Resistor, 220 Ohm, +/- 1%, 0.1 W, -55 to 155 degC, 0603 (1608 Metric), RoHS, Tape and Reel; Voltage Rating: 50 V; Resistance: 22 Ohm; Power Rating: 100 mW; Case\Package: 0603; ComponentLink2Description: Datasheet; PackageDescription: 2-Pin Surface Mount Device, Body 1.6 x 0.85 mm; PackageReference: 0603; ComponentLink1Description: Manufacturer URL; ComponentLink2URL: http://industrial.panasonic.com/cdbs/www-data/pdf/RDA0000/AOA0000C86.pdf; Height: 0.45 mm; Mount: Surface Mount; Case Code (Metric): 1608; Pins: 2; Width: 0.8 mm; Length: 1.6 mm; Package Quantity: 5000; Tolerance: 1%; ComponentLink1URL: http://www.panasonic.com/; Max Operating Temperature: 155 degC; Min Operating Temperature: -55 degC; RoHSCompliant: true; Packaging: Tape and Reel; Case Code (Imperial): 0603; DatasheetVersion: Apr-15; REACH SVHC: No SVHC; Voltage Rating (DC): 50 V
R18-R20 = CMP-2000-00180-1: Manufacturer: Panasonic; Part Number: ERJ-3EKF1001V
R25 R27 R29 = RES: RESISTOR; Value: 102k
R26 R28 R30 = RES: RESISTOR; Value: 19k6
R31 R32 = CMP-1012-00586-3: Precision Thick Film Chip Resistor, 4.7 KOhm, +/- 1%, -55 to 155 degC, 0603 (1608 Metric), RoHS, Tape and Reel; Resistance: 220 Ohm; Voltage Rating: 50 V; Elements: 4; Case\Package: 1205; Tolerance: 5%; Power Rating: 250 mW; PackageReference: 0603; Max Operating Temperature: 125 degC; REACH SVHC: No SVHC; Width: 0.063 inch; Length: 0.126 inch; Height: 0.024 inch; Mount: Surface Mount; Package Quantity: 1; DatasheetVersion: Apr-15; ComponentLink1Description: Manufacturer URL; Min Operating Temperature: -55 degC; Packaging: Tape and Reel; Radiation Hardening: No; ComponentLink2URL: http://industrial.panasonic.com/cdbs/www-data/pdf/RDA0000/AOA0000C86.pdf; Case Code (Metric): 3216; Pins: 8; Case Code (Imperial): 1206; Type (Resistor): Thick Film; RoHSCompliant: true; ComponentLink2Description: Datasheet; PackageDescription: 2-Pin Surface Mount Device, Body 1.6 x 0.85 mm; ComponentLink1URL: http://www.panasonic.com/
R33 = CMP-1013-00405-1: 120R 0.125W 1% 0805 (2012 Metric)  SMD; Case-Metric: 2012; Case-EIA: 0805; Tolerance: 1 %; Technology: SMT; Power: 0.125 W
SW1 = JS203011JCQN: SWITCH SLIDE DP3T 300MA 6V; Manufacturer: C&K; Temperature_Range_High: +85°C; Temperature_Range_Low: -40°C; helpURL: https://upverter.com/upn/revision/6f40db4ea45800d9/; ComponentLink2Description: Datasheet; Temperature: to; Package: SW_SMT_13MM_3MM6_DP3T; Price: 0.461720331896; ComponentLink1URL: https://upverter.com/upn/revision/6f40db4ea45800d9/; ComponentLink1Description: Upverter; ComponentLink2URL: http://www.ck-components.com/media/1422/js.pdf; RoHS: TRUE; Digikey_Description: Slide Switch DP3T Surface Mount; Voltage Rating: 6V; Lead Free: yes; Digikey_Partnumber: CKN10725CT-ND; Mouser_Partnumber: 611-JS203011JCQN; Octopart Part Number: JS203011JCQN; Supplier 1: Digi-Key; Part Number: JS203011JCQN; Supplier Part Number 1: CKN10725CT-ND
U1 = CMP-1655-00023-2: Ultra-Low-Power ARM Cortex-M4 32-bit MCU+FPU, 1024 KB Flash, 128 KB Internal RAM, 82 I/Os, 100-Pin LQFP, -40 to 85 degC, Tray; Manufacturer: STMicroelectronics; I/Os (High Current): 82; Internal RAM Size (kB): 128; Operating Frequency(F) (Processor speed) (MHz): 80; D/A Converter: 2; Supply Voltage(Vcc) min (V): 1.71; FLASH Size (Prog) (kB): 1024; Mounting Technology: Surface Mount; Package Description: 100-Pin Low Profile Quad Flat Package, Body 14 x 14 mm, Pitch 0.5 mm; ComponentLink2URL: http://www.st.com/st-web-ui/static/active/en/resource/technical/document/datasheet/DM00108833.pdf; PartNumber: STM32L486VGT6; ComponentLink2Description: Datasheet; Package Reference: LQFP100; ComponentLink1URL: http://www.st.com/; DatasheetVersion: Rev. 5; Packing: Tray; ComponentLink1Description: Manufacturer URL; Core: ARM Cortex-M4
U2 = CMP-0315-00073-2: 3.3 V CAN Transceiver, 17 mA, -40 to 85 degC, 8-pin SOIC (D), Green (RoHS & no Sb/Br); Manufacturer: Texas Instruments; Supply Voltage(s)(V): 3.3; Transient Pulse Protection(V): -25 to 25; ICC(Max)(mA): 17; Drivers Per Package: 1; Rating: Catalog; Code_JEDEC: MS-012AA; Mounting Technology: Surface Mount; PackageDescription: 8-Pin Plastic Small Outline Integrated Circuit, 4.9 x 3.9 mm, Pitch 1.27 mm Pitch; SubFamily: CAN; PackageVersion: revM, Jun-2011; Isolated: No; DatasheetVersion: SLOS346K; PackageReference: D0008A; Receivers Per Package: 1; Footprint: SN65HVD232; ComponentLink1Description: Datasheet; PartNumber: SN65HVD232D; Eco-Plan: Green (RoHS & no Sb/Br); ComponentLink1URL: http://www.ti.com/general/docs/lit/getliterature.tsp?genericPartNumber=SN65HVD232&fileType=pdf
U3 = W25M02GVZEIT: IC FLASH 2GBIT SPI 104MHZ 8WSON; Supplier 1: Digi-Key
U4 = FT230XS-R: IC USB SERIAL BASIC UART 16SSOP; MF: FTDI, Future; MP: FT230XS; Price: None; Availability: Unavailable; Package: SSOP-16 FTDI; SnapEDA_Link: https://www.snapeda.com/parts/FT230XS/FTDI%2C%20Future%20Technology%20Devices%20International%20Ltd/view-part/433817/?ref=snap; Value: *; Supplier 1: Digi-Key
U5 = CMP-2000-07467-2: IMU ACCEL/GYRO I2C/SPI 14LGA; Manufacturer: STMicroelectronics; Resolution: 16bits; Max Supply Voltage: 3.6V; Sensor Type: Temperature,Accelerometer,Gyroscope; Sensor Output: I2C,SPI; Gyro Range: 125/250/500/1000/2000°/s; Accel Range: 2/4/8/16g; Operating Supply Current: 0.29-0.65mA; Min Supply Voltage: 1.62V; Package: LGA-14L-DM00249496; Temperature Range High: +85°C; Automotive: No; Footprint Url: https://www.st.com/resource/en/technical_note/cd00134799.pdf; Height: 0.86mm; Device Class L1: Sensors; Octopart: https://octopart.com/lsm6dsltr-stmicroelectronics-66358193; Device Class L2: Motion Sensors; Lead Free: Yes; Category: IC; Device Class L3: Inertial Measurement Units (IMUs); ComponentLink2Description: Datasheet; RoHS: TRUE; ComponentLink2URL: https://www.st.com/resource/en/datasheet/lsm6dsl.pdf; Temperature Range Low: -40°C; Manufacturer Part Number: LSM6DSLTR; Mouser Description: iNEMO inertial module: always-on 3D accelerometer and 3D gyroscope; Digikey Description: IMU ACCEL/GYRO I2C/SPI 14LGA; Temperature: -40°C to +85°C
U6 = H3LIS331DLTR: ACCEL 100-400G I2C/SPI 16TFLGA; MF: STMicroelectronics; MP: H3LIS331DL; Package: TFLGA-16 STMicroelectronics; SnapEDA_Link: https://www.snapeda.com/parts/H3LIS331DL/STMicroelectronics/view-part/106099/?ref=snap; Availability: Unavailable; Price: None; Value: *; Supplier 1: Digi-Key; Supplier Part Number 1: 497-13903-1-ND
U7 = BMI088: ACCELEROMETER 16LGA; MF: Bosch Sensortec; Availability: Unavailable; MP: BMI088; Price: None; Value: *; SnapEDA_Link: https://www.snapeda.com/parts/BMI088/Bosch%20Sensortec/view-part/2774026/?ref=snap; Package: VFLGA-16 Bosch Sensortec; Supplier 1: Digi-Key; Supplier Part Number 1: 828-1082-1-ND
U8 = LIS2MDLTR: SENSOR MR I2C/SPI 12LGA; MF: STMicroelectronics; Value: *; MP: LIS2MDLTR; SnapEDA_Link: https://www.snapeda.com/parts/LIS2MDLTR/STMicroelectronics/view-part/839420/?ref=snap; Package: WFLGA-12 STMicroelectronics; Digi-Key_Part_Number: 497-17588-1-ND; Digi-Key_Purchase_URL: https://www.digikey.com/product-detail/en/stmicroelectronics/LIS2MDLTR/497-17588-1-ND/7565512?utm_source=snapeda&utm_medium=aggregator&utm_campaign=symbol; Supplier 1: Digi-Key; Supplier Part Number 1: 497-17588-1-ND
U9 = MS560702BA03-50: BAROMETRIC PRESSURE SENSOR; MF: TE Connectivity; MP: MS560702BA03-50; EU_RoHS_Compliance: Compliant; Package: SMD-8 TE Connectivity; TE_purchase_URL: https://www.te.com/usa-en/product-MS560702BA03-50.html?te_bu=Cor&te_type=disp&te_campaign=seda_glo_cor-seda-global-disp-prtnr-fy19-seda-model-bom-cta_sma-317_1&elqCampaignId=32493; SnapEDA_Link: https://www.snapeda.com/parts/MS560702BA03-50/TE%20Connectivity%20ALCOSWITCH%20Switches/view-part/480584/?ref=snap; Availability: Unavailable; Price: None; Value: *; Supplier 1: Digi-Key; Comment_1: *; Supplier Part Number 1: 223-1198-1-ND
XTAL1 = NX3215SA-32.768KHZ-EXS00A-MU00525: CRYSTAL 32.768KHZ 6PF SMD; Supplier 1: Digi-Key
XTAL2 = NX3225GD-8MHZ-STD-CRA-3: CRYSTAL 8.0000MHZ 8PF SMD; Supplier 1: Digi-Key